# Altium schematic sheet 4_Display_NFC.SchDoc: SD Card and NFC
size A4; DrawnBy: Cristian Oprea; Revision: 1; SheetNumber: 4; SheetTotal: 4
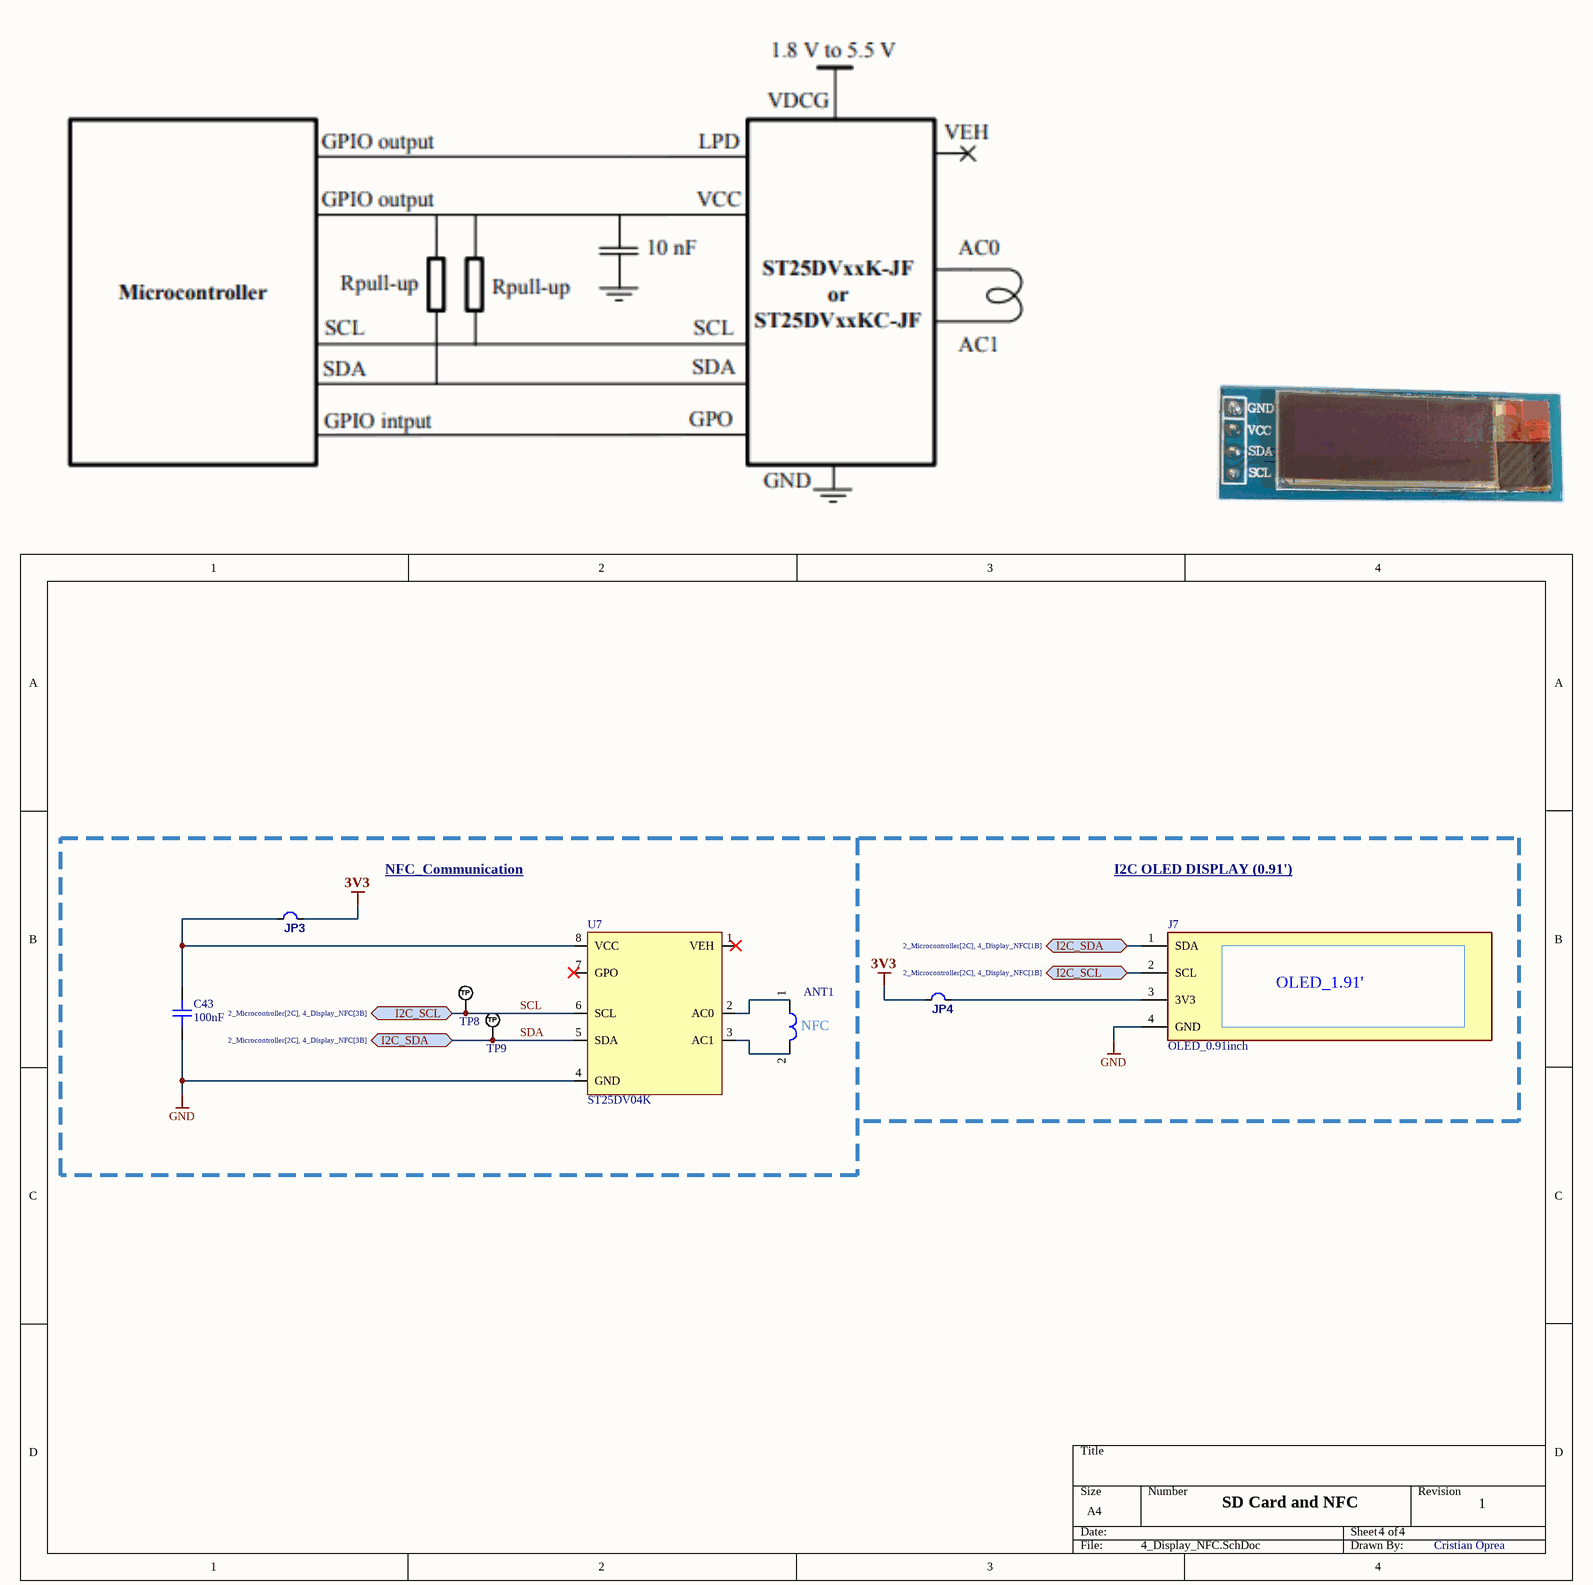
[diagram p0: 4_Display_NFC.SchDoc]

## Parts
ANT1  NFC_ANTENNA  [ANT16]  (value not drawn)
C43  100nF  [C0603]
J7  OLED_0.91inch  [OLED_0.91in]
JP3  JUMPER  [HEADER_1x2_2.54]  (value not drawn)
JP4  JUMPER  [HEADER_1x2_2.54]  (value not drawn)
TP8  TP_NOBOM  [TEST_PAD_THD]  (value not drawn)  (no BOM)
TP9  TP_NOBOM  [TEST_PAD_THD]  (value not drawn)  (no BOM)
U7  ST25DV04K  [SOIC-SN8_N]

## Ports
I2C_SCL (bidir, see 2_Microcontroller[2C], 4_Display_NFC[1B]), I2C_SCL (bidir, see 2_Microcontroller[2C], 4_Display_NFC[3B]), I2C_SDA (bidir, see 2_Microcontroller[2C], 4_Display_NFC[1B]), I2C_SDA (bidir, see 2_Microcontroller[2C], 4_Display_NFC[3B])

## Nets
3V3: JP3.2 JP4.1
GND: C43.1 J7.4(GND) U7.4(GND)
SCL: J7.2(SCL) TP8.1(TP) U7.6(SCL) ; port I2C_SCL
SDA: J7.1(SDA) TP9.1(TP) U7.5(SDA) ; port I2C_SDA
NetANT1_1: ANT1.1 U7.2(AC0)
NetANT1_2: ANT1.2 U7.3(AC1)
NetC43_2: C43.2 JP3.1 U7.8(VCC)
NetJ7_3: J7.3(3V3) JP4.2

Not connected (* = marked no-connect by the designer): U7 1(VEH)* 7(GPO)*

## Notes on the sheet
- (near JP3) VDD supplied only for debug after reset
- NFC_Communication
- (near J7) VDD supplied only for debug in field
- I2C OLED DISPLAY (0.91')
- (in symbol NFC_ANTENNA) NFC
- (in symbol OLED_0.91inch) OLED_1.91'

## Library data of the parts
C43 = CAP_0603: Capacitor SMD 0603; Manufacturer: *; Manufacturer Part Number: *; Distributor Link: *; LCSC: *; Rating: *; Dielectric: *
J7 = OLED_0.91inch: I2C OLED display (horizontal) 0.91inch
JP3 JP4 = JUMPER: *; PackageReference: *; Manufacturer Part Number 1: *
TP8 TP9 = TEST_POINT_RND_1MM: Test Point Round 1mm (NO BOM)
U7 = ST25DV04K: ST25DO4K NFC module with I2C